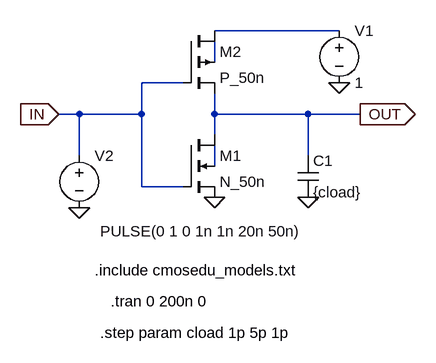
[diagram p0: schematic cmosinv (2).asc]
cmosinv (2).asc, the LTspice schematic file:
Version 4
SHEET 1 880 680
WIRE 400 32 208 32
WIRE 208 80 208 48
WIRE 160 112 96 112
WIRE 0 160 -32 160
WIRE 96 160 96 112
WIRE 96 160 0 160
WIRE 208 160 208 128
WIRE 352 160 208 160
WIRE 432 160 352 160
WIRE 208 192 208 160
WIRE 0 224 0 160
WIRE 352 224 352 160
WIRE 208 240 208 208
WIRE 96 272 96 160
WIRE 160 272 96 272
FLAG 400 112 0
FLAG 208 288 0
FLAG -32 160 IN
IOPIN -32 160 In
FLAG 432 160 OUT
IOPIN 432 160 Out
FLAG 0 304 0
FLAG 352 288 0
SYMBOL nmos4 160 192 R0
SYMATTR InstName M1
SYMATTR Value N_50n
SYMATTR Value2 l=50n w=0.5u
SYMBOL pmos4 160 32 R0
SYMATTR InstName M2
SYMATTR Value P_50n
SYMATTR Value2 l=50n w=0.5u
SYMBOL voltage 400 16 R0
WINDOW 123 0 0 Left 0
WINDOW 39 0 0 Left 0
SYMATTR InstName V1
SYMATTR Value 1
SYMBOL cap 336 224 R0
SYMATTR InstName C1
SYMATTR Value {cload}
SYMBOL voltage 0 208 R0
WINDOW 3 32 132 Left 2
WINDOW 123 0 0 Left 0
WINDOW 39 0 0 Left 0
SYMATTR InstName V2
SYMATTR Value PULSE(0 1 0 1n 1n 20n 50n)
TEXT 24 400 Left 2 !.include cmosedu_models.txt
TEXT 48 448 Left 2 !.tran 0 200n 0
TEXT 32 496 Left 2 !.step param cload 1p 5p 1p

The netlist it stands for:
* cmosinv (2).asc
M1 OUT IN 0 N003 N_50n l=50n w=0.5u
M2 N001 IN OUT N002 P_50n l=50n w=0.5u
V1 N001 0 1
C1 OUT 0 {cload}
V2 IN 0 PULSE(0 1 0 1n 1n 20n 50n)
.model NMOS NMOS
.model PMOS PMOS
.lib standard.mos
.include cmosedu_models.txt
.tran 0 200n 0
.step param cload 1p 5p 1p
.backanno
.end